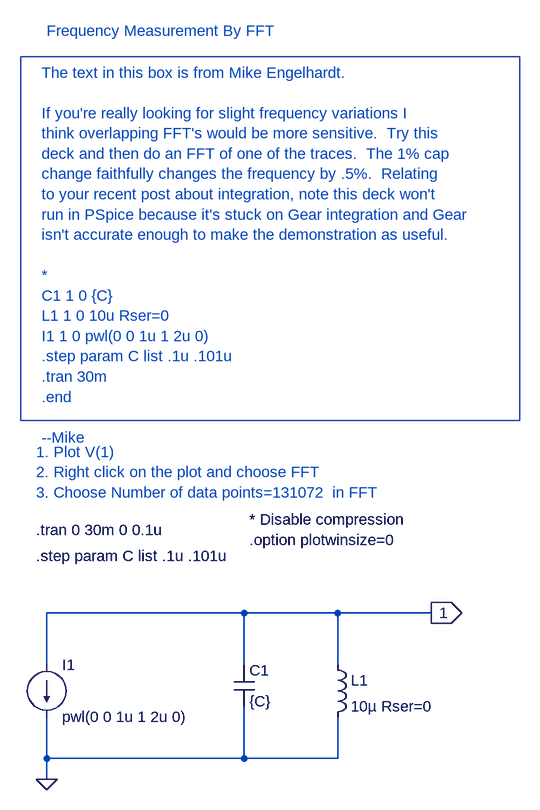
[diagram p0: schematic FreqMeasFFT.asc]
FreqMeasFFT.asc, the LTspice schematic file:
Version 4
SHEET 1 1076 852
WIRE -96 656 -96 576
WIRE -96 576 208 576
WIRE -96 736 -96 800
WIRE -96 800 208 800
WIRE 208 656 208 576
WIRE 208 576 352 576
WIRE 208 720 208 800
WIRE 208 800 352 800
WIRE 352 656 352 576
WIRE 352 576 496 576
WIRE 352 736 352 800
WIRE -96 800 -96 832
FLAG -96 832 0
FLAG 496 576 1
IOPIN 496 576 Out
SYMBOL current -96 656 R0
SYMATTR InstName I1
SYMATTR Value pwl(0 0 1u 1 2u 0)
SYMBOL cap 192 656 R0
SYMATTR InstName C1
SYMATTR Value {C}
SYMBOL ind 336 640 R0
SYMATTR InstName L1
SYMATTR Value 10µ Rser=0
TEXT -104 -256 Left 0 ;The text in this box is from Mike Engelhardt.\n \nIf you're really looking for slight frequency variations I\nthink overlapping FFT's would be more sensitive.  Try this\ndeck and then do an FFT of one of the traces.  The 1% cap\nchange faithfully changes the frequency by .5%.  Relating\nto your recent post about integration, note this deck won't\nrun in PSpice because it's stuck on Gear integration and Gear\nisn't accurate enough to make the demonstration as useful.\n \n*\nC1 1 0 {C}\nL1 1 0 10u Rser=0\nI1 1 0 pwl(0 0 1u 1 2u 0)\n.step param C list .1u .101u\n.tran 30m\n.end\n \n--Mike
TEXT -112 488 Left 0 !.step param C list .1u .101u
TEXT -112 448 Left 0 !.tran 0 30m 0 0.1u
TEXT 216 432 Left 0 !* Disable compression\n.option plotwinsize=0
TEXT -112 328 Left 0 ;1. Plot V(1)\n2. Right click on the plot and choose FFT \n3. Choose Number of data points=131072  in FFT
TEXT -96 -320 Left 0 ;Frequency Measurement By FFT
RECTANGLE Normal 632 280 -136 -280

The netlist it stands for:
* FreqMeasFFT.asc
I1 1 0 pwl(0 0 1u 1 2u 0)
C1 1 0 {C}
L1 1 0 10µ Rser=0
* The text in this box is from Mike Engelhardt.
* If you're really looking for slight frequency variations I
* think overlapping FFT's would be more sensitive.  Try this
* deck and then do an FFT of one of the traces.  The 1% cap
* change faithfully changes the frequency by .5%.  Relating
* to your recent post about integration, note this deck won't
* run in PSpice because it's stuck on Gear integration and Gear
* isn't accurate enough to make the demonstration as useful.
* *
* C1 1 0 {C}
* L1 1 0 10u Rser=0
* I1 1 0 pwl(0 0 1u 1 2u 0)
* .step param C list .1u .101u
* .tran 30m
* .end
* --Mike
.step param C list .1u .101u
.tran 0 30m 0 0.1u
* Disable compression
.option plotwinsize=0
* 1. Plot V(1)
* 2. Right click on the plot and choose FFT
* 3. Choose Number of data points=131072  in FFT
* Frequency Measurement By FFT
.backanno
.end